# Altium schematic sheet BUCK_5v_TPS54340_P-MOS.SchDoc: Memristor Power 5.0
size A4; Author: Nikola Rašević; Organization: Memristor-Robotics; Address1: Vladimira Perića Valtera 2; Address2: 21000 Novi Sad; Address3: Serbia; Revision: v1
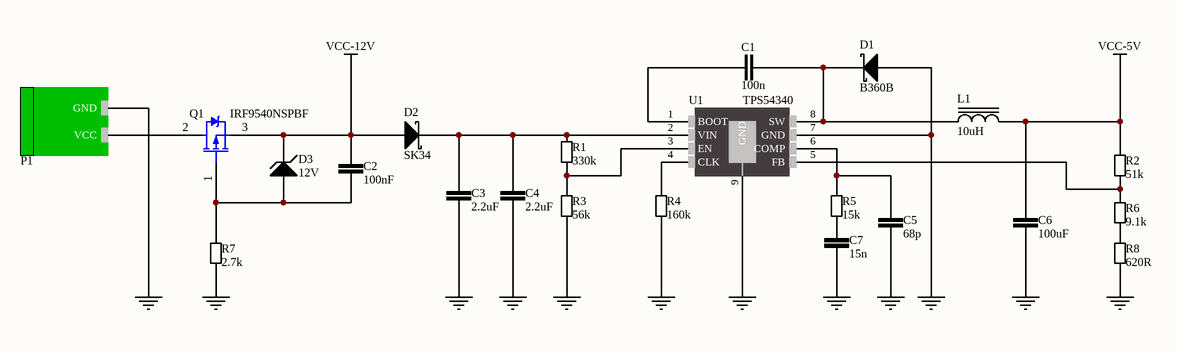
[diagram p0: BUCK_5v_TPS54340_P-MOS.SchDoc]

## Parts
C1  100n  [CER_0603]
C2  100nF  [CER_0805]
C3  2.2uF  [CER_1210]
C4  2.2uF  [CER_1210]
C5  68p  [CER_0603]
C6  100uF  [CER_1210]
C7  15n  [CER_0603]
D1  B360B  [DO214AC]
D2  SK34  [DO214AC]
D3  12V  [DO214AC]
L1  10uH  [INDUCTOR_SS1260-103MLD]
P1  2EDGRC-5.08-02P-14-00A(H)  [PWR_Con]  (value not drawn)
Q1  IRF9540NSPBF  [D2PAK-2]
R1  330k  [RESC2013X38N-0805-NOOVERLAY]
R2  51k  [RESC2013X38N-0805-NOOVERLAY]
R3  56k  [RESC2013X38N-0805-NOOVERLAY]
R4  160k  [RESC2013X38N-0805-NOOVERLAY]
R5  15k  [RESC2013X38N-0805-NOOVERLAY]
R6  9.1k  [RESC2013X38N-0805-NOOVERLAY]
R7  2.7k  [RESC2013X38N-0805-NOOVERLAY]
R8  620R  [RESC2013X38N-0805-NOOVERLAY]
U1  TPS54340  [HSOP-8]

## Nets
GND: C3.1 C4.1 C5.1 C6.1 C7.1 D1.2(Anode) P1.1(GND) R3.1 R4.1 R7.1 R8.1 U1.7(GND) U1.9(GND)
VCC-5V: C6.2 L1.2 R2.2
VCC-12V: C2.2 D2.2(Anode) D3.1(Cathode) Q1.3(S)
NetC1_1: C1.1 U1.1(BOOT)
NetC1_2: C1.2 D1.1(Cathode) L1.1 U1.8(SW)
NetC2_1: C2.1 D3.2(Anode) Q1.1(G) R7.2
NetC3_2: C3.2 C4.2 D2.1(Cathode) R1.2 U1.2(VIN)
NetC5_2: C5.2 R5.2 U1.6(COMP)
NetC7_2: C7.2 R5.1
NetP1_2: P1.2(VCC) Q1.2(D)
NetR1_1: R1.1 R3.2 U1.3(EN)
NetR2_1: R2.1 R6.2 U1.5(FB)
NetR4_2: R4.2 U1.4(CLK)
NetR6_1: R6.1 R8.2

## Notes on the sheet
- Title
- Date:
- Design Engineer:
- Time:
- Revision:
- Sheet
- of
- Size:
- A4
- www.memristor-robotics.io
- File:

## Library data of the parts
C1 = 06032105: CAP CER 100n 10V X5R 10% 0603; Capacitance: 100n
C2 = 00002105: CAP CER 100n 50V X7R 10% 0805; Capacitance: 100nF
C3 C4 = 00001225: CAP CER 2.2u; Value: 2.2uF
C5 = 06032680: CAP CER 68p 0603; Capacitance: 68p
C6 = 00002108: CAP CER 100u X5R 6.3V 10% 1210; Capacitance: 100uF
C7 = 06032153: CAP CER 15n 0603; Capacitance: 15n
D1 = B360B: DIODE SCHOTTKY 60V 3A DO214AC; Manufacturer: Vishay Semiconductor Diodes Division; Barcode: 0100000007488; id: 62; Assembly: SMD; Speed: Fast Recovery =< 500ns, > 200mA (Io); Voltage  Forward: 550mV @ 3A; item_id: 1025; Recommended Rating: Silver; Manufacturer Part Number: B360B; Category: Discrete Semiconductor Products; Datasheet URL: http://www.vishay.com/docs/88896/b330la.pdf; Package Case: DO-214AC, SMA; Family: DIODE; Voltage  DC Reverse: 60V; Current  Average Rectified: 3A; Diode Type: Schottky; Part Type: Discrete Semiconductors
D2 = SK34: DIODE SCHOTTKY 40V 3A DO214AC; Manufacturer: Vishay Semiconductor Diodes Division; Barcode: 0100000007488; id: 62; Assembly: SMD; Speed: Fast Recovery =< 500ns, > 200mA (Io); Voltage  Forward: 550mV @ 3A; item_id: 1025; Recommended Rating: Silver; Manufacturer Part Number: SK34; Category: Discrete Semiconductor Products; Datasheet URL: http://www.vishay.com/docs/88896/b330la.pdf; Package Case: DO-214AC, SMA; Family: DIODE; Voltage  DC Reverse: 40V; Current  Average Rectified: 3A; Diode Type: Schottky; Part Type: Discrete Semiconductors
D3 = ZENER: DIODE ZENER; Manufacturer: Vishay Semiconductor Diodes Division; Manufacturer Part Number: B360B; Barcode: 0100000007488; id: 62; Assembly: SMD; Speed: Fast Recovery =< 500ns, > 200mA (Io); Voltage  DC Reverse: 60V; Current  Average Rectified: 3A; Voltage  Forward: 550mV @ 3A; Diode Type: Schottky; item_id: 1025; Recommended Rating: Silver; Category: Discrete Semiconductor Products; Datasheet URL: http://www.vishay.com/docs/88896/b330la.pdf; Package Case: DO-214AC, SMA; Family: DIODE; Part Type: Discrete Semiconductors; Refferent Voltage: 12V
L1 = Inductor_10uH: FIXED IND 10uH 5.3A; Manufacturer: Coilcraft; Manufacturer Part Number: XAL7030-103MEB; Barcode: 2911010049126; id: 7; Assembly: SMD; Tolerance: 20%; Value: 10u; DC Resistance: 62.7mOhm; item_id: 5593; Category: Inductors, Coils, Chokes; Datasheet URL: http://www.mouser.com/ds/2/597/xal7030-270749.pdf; Package Case: 8x8mm; Inductance: 10uH; Current Rating: 5.3A; Family: INDUCTOR; Part Type: Inductor, Transf, Filter, Ferrite
P1 = 00000002: TERM BLOCK HDR 2POS 90DEG 5.08MM; Suplier: TME; Manufacturer Part Number: 2EDGRC-5.08-02P-14-00A(H); Suplier Product Link: https://www.tme.eu/en/details/2edgrc5.08-2p14/pluggable-terminal-blocks/degson-electronics/2edgrc-508-02p-14-00ah/; Price: 0.1304
Q1 = IRF9540N: P-MOS; Manufacturer: INTERNATIONAL RECTIFIER; Manufacturer Part Number: IRF9540NSPBF; Order Code: IRF9540NS; Package: TO-263 SMD; Price: DIN 62.54; Supplier: Comet.rs
R1 = 00003303: RES SMD 330 kOhm 1/8W 0805; Power: 0.125W, 1/8W; Resistance: 330k; Assembly: SMD; Barcode: 00003303
R2 = 00005102: RES SMD 51 kOhm 1/8W 0805; Power: 0.125W, 1/8W; Resistance: 51k; Assembly: SMD; Barcode: 00005102
R3 = 00005602: RES SMD 56 kOhm 1/8W 0805; Power: 0.125W, 1/8W; Barcode: 00004701; Resistance: 56k; Assembly: SMD
R4 = 00001603: RES SMD 160 kOhm 1/8W 0805; Power: 0.125W, 1/8W; Resistance: 160k; Assembly: SMD; Barcode: 00001603
R5 = 00001502: RES SMD 15 kOhm 1/8W 0805; Power: 0.125W, 1/8W; Resistance: 15k; Assembly: SMD; Barcode: 00001502
R6 = 00009101: RES SMD 9.1 kOhm 1/8W 0805; Power: 0.125W, 1/8W; Resistance: 9.1k; Assembly: SMD; Barcode: 00009101
R7 = 00002701: RES SMD 2.7 kOhm 1/8W 0805; Power: 0.125W, 1/8W; Barcode: 00004701; Resistance: 2.7k; Assembly: SMD
R8 = 00006200: RES SMD 620 Ohm 1/8W 0805; Power: 0.125W, 1/8W; Resistance: 620R; Assembly: SMD; Barcode: 00006200
U1 = TPS54340: IC REG BUCK ADJ 3.5A 8SOPWRPAD; Assembly: SMD; Manufacturer Part Number: TPS54340